# Altium schematic sheet VALVEBOARD_ValveDrive.SchDoc
size A4; SheetNumber: 8; SheetTotal: 9
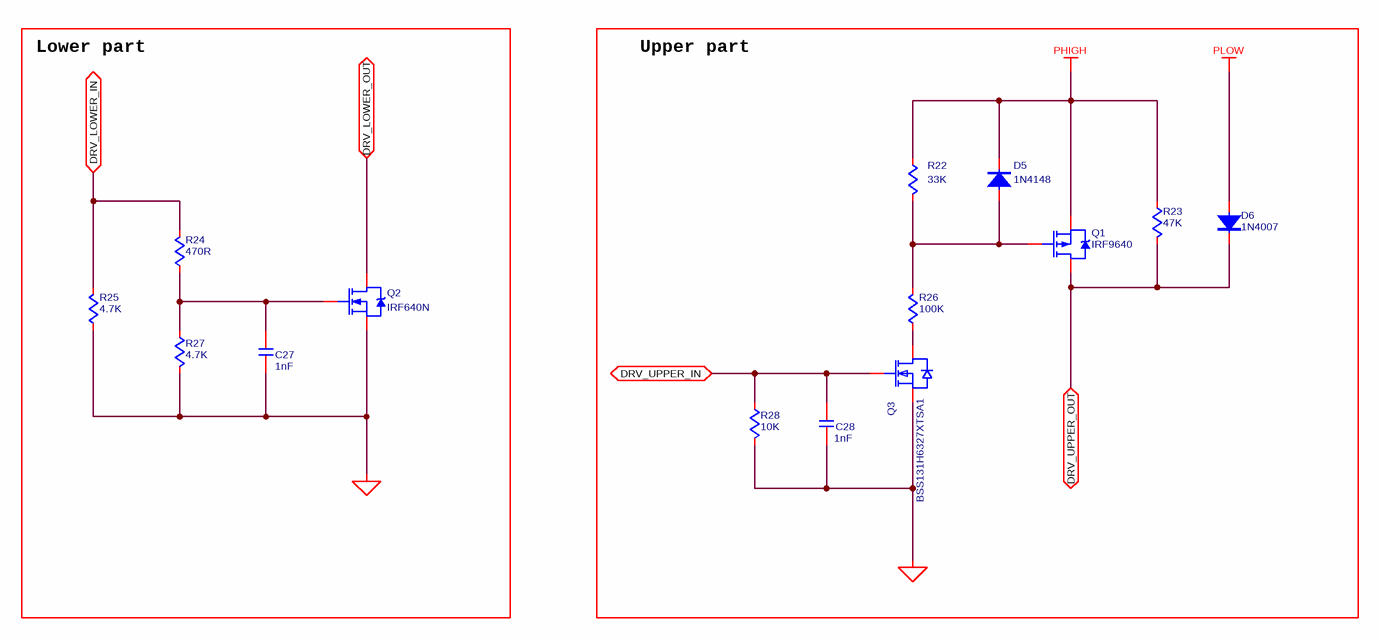
[diagram p0: VALVEBOARD_ValveDrive.SchDoc]

## Parts
C27  value 1nF  [C0603]  (hidden comment: C-NOMO)
C28  value 1nF  [C0603]  (hidden comment: C-NOMO)
D5  1N4148  [sod-123]
D6  1N4007  [1N4148]
Q1  IRF9640  [TO-220AB]
Q2  IRF640N  [TO-220AB]
Q3  BSS131H6327XTSA1  [BSS131H6327XTSA1]
R22  value 33K  [R0805]  (hidden comment: R)
R23  value 47K  [R2512]  (hidden comment: R)
R24  value 470R  [R0603]  (hidden comment: R)
R25  value 4.7K  [R0603]  (hidden comment: R)
R26  value 100K  [R0805]  (hidden comment: R)
R27  value 4.7K  [R0603]  (hidden comment: R)
R28  value 10K  [R0603]  (hidden comment: R)

## Blocks framed on the sheet
Lower part: C27 Q2 R24 R25 R27
Upper part: C28 D5 D6 Q1 Q3 R22 R23 R26 R28

## Ports
DRV_LOWER_IN (bidir), DRV_LOWER_OUT (bidir), DRV_UPPER_IN (bidir), DRV_UPPER_OUT (bidir)

## Nets
PGND: C27.1 C28.1 Q2.3(S) Q3.S R25.2 R27.1 R28.1
PHIGH: D5.1 Q1.3(S) R22.2 R23.2
PLOW: D6.2
DRV_LOWER_IN: R24.1 R25.1 ; port DRV_LOWER_IN
DRV_LOWER_OUT: Q2.2(D) ; port DRV_LOWER_OUT
DRV_UPPER_IN: C28.2 Q3.G R28.2 ; port DRV_UPPER_IN
DRV_UPPER_OUT: D6.1 Q1.2(D) R23.1 ; port DRV_UPPER_OUT
NetC27_2: C27.2 Q2.1(G) R24.2 R27.2
NetD5_2: D5.2 Q1.1(G) R22.1 R26.1
NetQ3_D: Q3.D R26.2

## Library data of the parts
C27 C28 = C-NOMO: voltage: 25V; precision: 5%
D5 D6 = DIOD1
Q1 = IRF9640: P-Channel Power MOSFET; Note: Pin 4 not drawn and electrically connected to Pin 2.; Published: 8-Jun-2000; LatestRevisionDate: 17-Jul-2002; LatestRevisionNote: Re-released for DXP Platform.; DatasheetVersion: PD-9.390D; PackageVersion: Feb-1997; PackageReference: TO-220AB; Publisher: Altium Limited; PackageDescription: TO, Thru-Hole, Vertical, Heatsink Mounted; 3 In-Line Leads; Pitch 2.54 mm; ComponentLink1Description: Manufacturer Link; ComponentLink1URL: http://www.irf.com/
Q2 = IRF640N: N-Channel Power MOSFET; Note: Pin 2 is electrically connected to pin 4.; Published: 8-Jun-2000; LatestRevisionDate: 17-Jul-2002; LatestRevisionNote: Re-released for DXP Platform.; DatasheetVersion: PD-9.814; PackageVersion: Feb-1997; PackageReference: TO-220AB; Publisher: Altium Limited; PackageDescription: TO, Thru-Hole, Vertical, Heatsink Mounted; 3 In-Line Leads; Pitch 2.54 mm; ComponentLink1Description: Manufacturer Link; ComponentLink1URL: http://www.irf.com/
R22-R28 = R: precision: 1%
Q3 = BSS131H6327XTSA1: Supplier 1: LCSC; Supplier Part Number 1: C151498